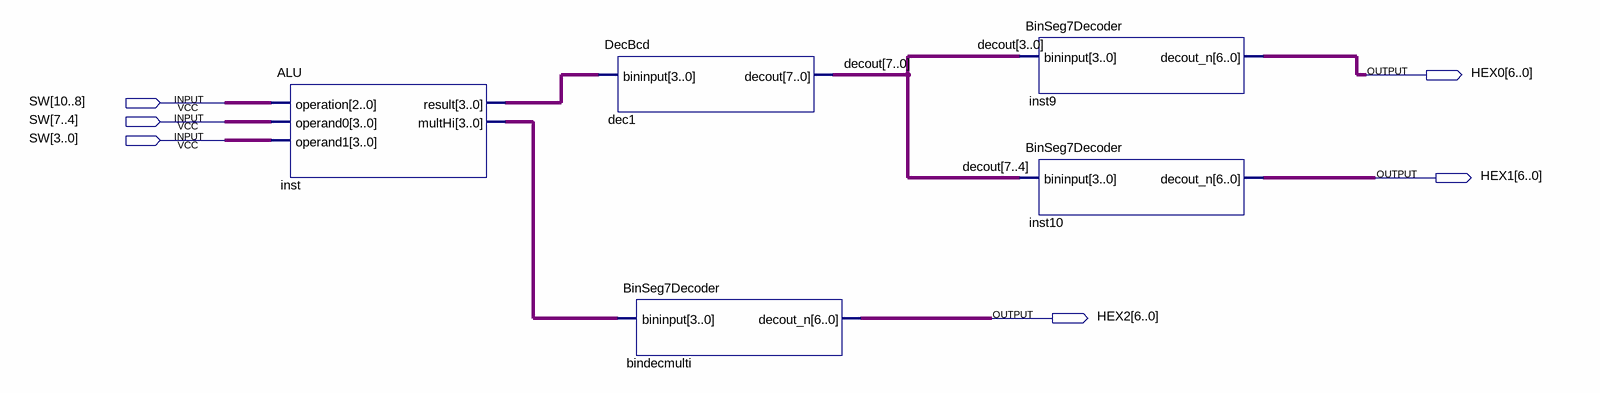
[diagram p0: schematic sheet]
// Quartus schematic ALU7SegDisplay.bdf as structural Verilog: 5 symbols, 6 pins
module ALU7SegDisplay (
  input  [10:0] SW,
  output [6:0] HEX0,
  output [6:0] HEX1,
  output [6:0] HEX2
);

  wire [3:0] inst_multhi, inst_result;
  wire [7:0] decout;

  ALU inst (.operation(SW[10:8]), .operand0(SW[7:4]), .operand1(SW[3:0]), .result(inst_result), .multHi(inst_multhi));
  DecBcd dec1 (.bininput(inst_result), .decout(decout));
  BinSeg7Decoder bindecmulti (.bininput(inst_multhi), .decout_n(HEX2));
  BinSeg7Decoder inst9 (.bininput(decout[3:0]), .decout_n(HEX0));
  BinSeg7Decoder inst10 (.bininput(decout[7:4]), .decout_n(HEX1));
endmodule
